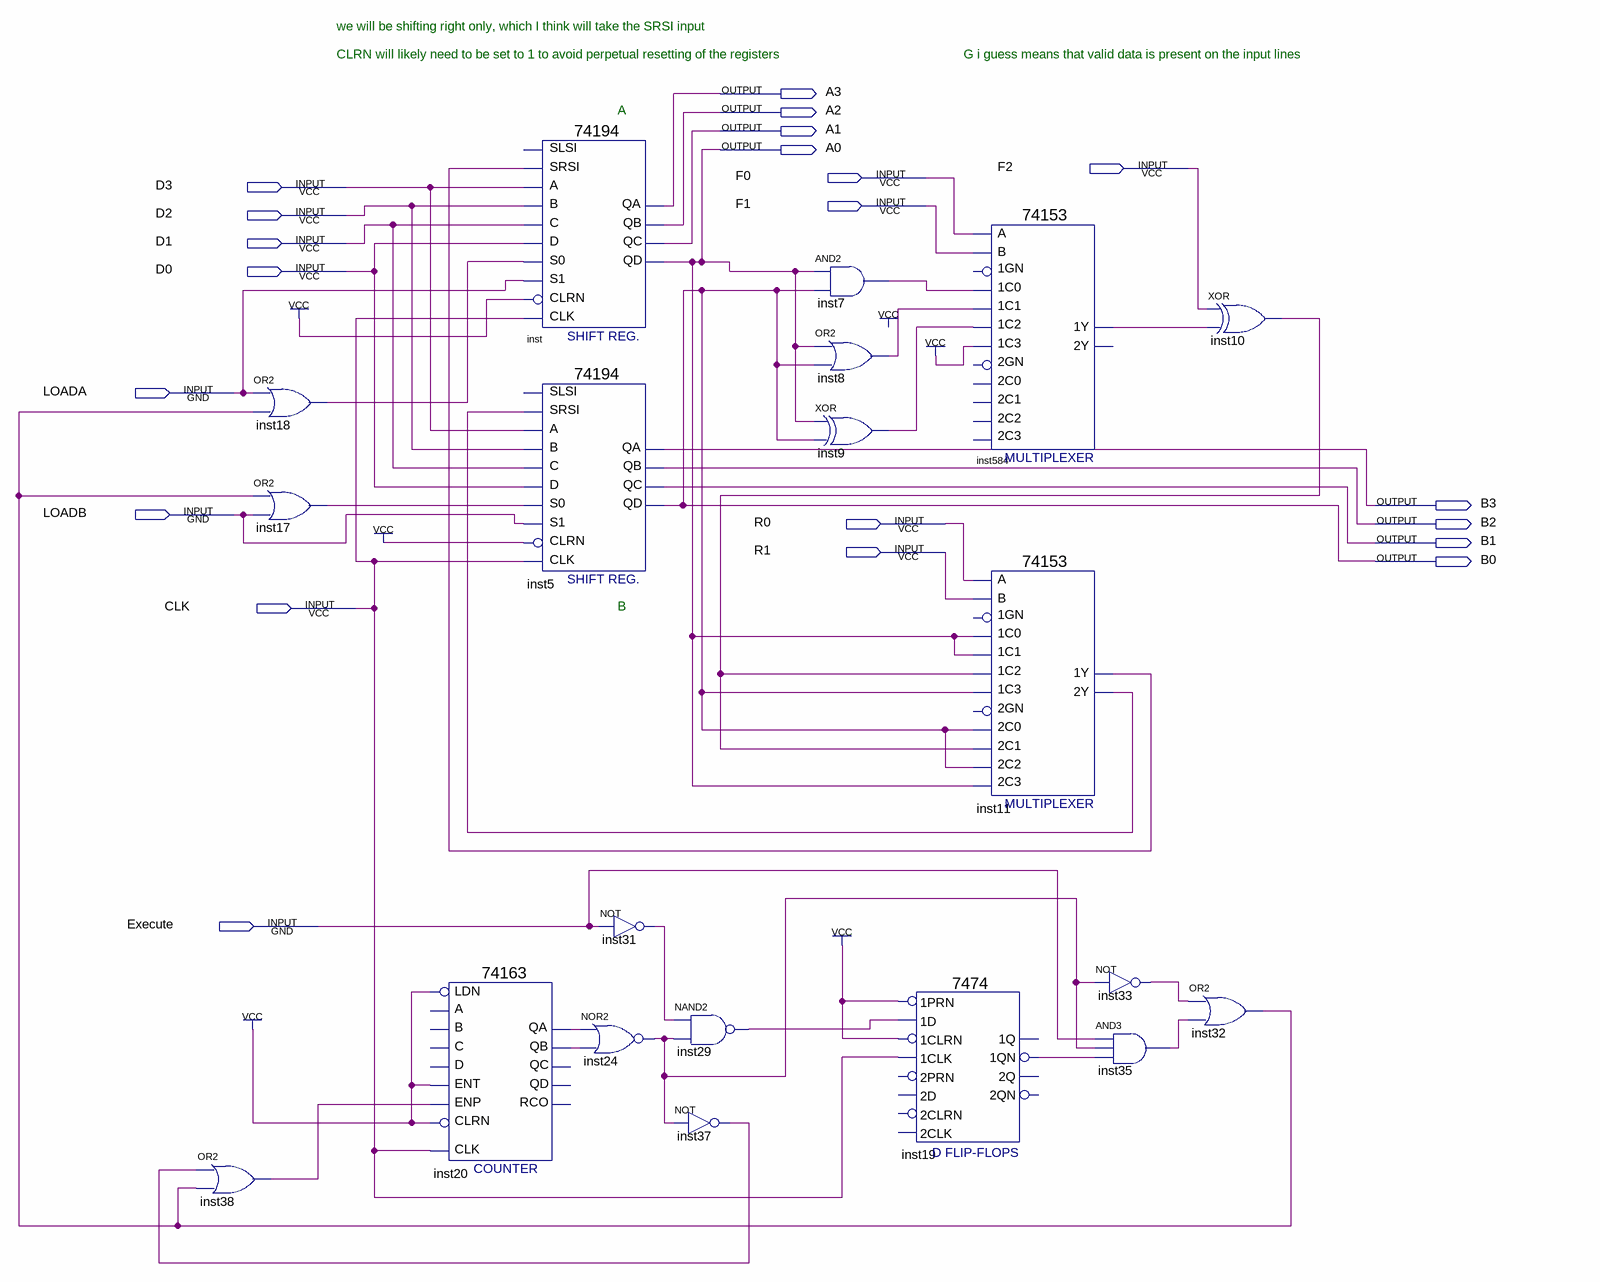
[diagram p0: schematic sheet]
// Quartus schematic Lab1.bdf as structural Verilog: 20 symbols, 21 pins
module Lab1 (
  input  F2,
  input  F0,
  input  D3,
  input  F1,
  input  D2,
  input  D1,
  input  D0,
  input  LOADA,
  input  LOADB,
  input  R0,
  input  R1,
  input  CLK,
  input  Execute,
  output A3,
  output A2,
  output A1,
  output A0,
  output B3,
  output B2,
  output B1,
  output B0
);

  wire inst7_out, inst8_out, inst9_out, inst10_out, inst11_1y, inst11_2y, inst17_out, inst18_out, inst19_1qn,
       inst20_qa, inst20_qb, inst24_out, inst29_out, inst31_out, inst32_out, inst33_out, inst35_out,
       inst37_out, inst38_out, inst584_1y;

  or inst38 (inst38_out, inst37_out, inst32_out);
  or inst18 (inst18_out, LOADA, inst32_out);
  or inst17 (inst17_out, inst32_out, LOADB);
  \74163  inst20 (
    .ENT(1'b1), .CLRN(1'b1), .CLK(CLK), .ENP(inst38_out), .LDN(1'b1), .QA(inst20_qa), .QB(inst20_qb));  // open: C, B, A, D, QC, QD, RCO
  \74194  inst (
    .SRSI(inst11_1y), .B(D2), .C(D1), .CLK(CLK), .CLRN(1'b1), .D(D0), .S1(LOADA), .S0(inst18_out), .A(D3),
    .QA(A3), .QB(A2), .QC(A1), .QD(A0));  // open: SLSI
  \74194  inst5 (
    .SRSI(inst11_2y), .B(D2), .C(D1), .CLK(CLK), .CLRN(1'b1), .D(D0), .S1(LOADB), .S0(inst17_out), .A(D3),
    .QA(B3), .QB(B2), .QC(B1), .QD(B0));  // open: SLSI
  not inst31 (inst31_out, Execute);
  nor inst24 (inst24_out, inst20_qa, inst20_qb);
  nand inst29 (inst29_out, inst31_out, inst24_out);
  not inst37 (inst37_out, inst24_out);
  and inst7 (inst7_out, A0, B0);
  or inst8 (inst8_out, A0, B0);
  xor inst9 (inst9_out, A0, B0);
  \7474  inst19 (
    .\1CLK (CLK), .\1D (inst29_out), .\1PRN (1'b1), .\1CLRN (1'b1), .\1QN (inst19_1qn));  // open: 2D, 2PRN, 2CLK, 2CLRN, 2Q, 2QN, 1Q
  \74153  inst584 (
    .\1C1 (inst8_out), .\1C0 (inst7_out), .\1C2 (inst9_out), .\1C3 (1'b1), .B(F1), .A(F0), .\1Y (inst584_1y));  // open: 1GN, 2C0, 2GN, 2C2, 2C1, 2C3, 2Y
  \74153  inst11 (
    .\1C1 (A0), .\1C0 (A0), .\2C0 (B0), .\2C2 (B0), .\1C2 (inst10_out), .\1C3 (B0), .B(R1), .A(R0),
    .\2C1 (inst10_out), .\2C3 (A0), .\1Y (inst11_1y), .\2Y (inst11_2y));  // open: 1GN, 2GN
  not inst33 (inst33_out, inst24_out);
  and inst35 (inst35_out, Execute, inst24_out, inst19_1qn);
  or inst32 (inst32_out, inst33_out, inst35_out);
  xor inst10 (inst10_out, F2, inst584_1y);

  // Notes on the sheet:
  //   we will be shifting right only, which I think will take the SRSI input
  //   CLRN will likely need to be set to 1 to avoid perpetual resetting of the registers
  //   G i guess means that valid data is present on the input lines
  //   A
  //   B
endmodule
